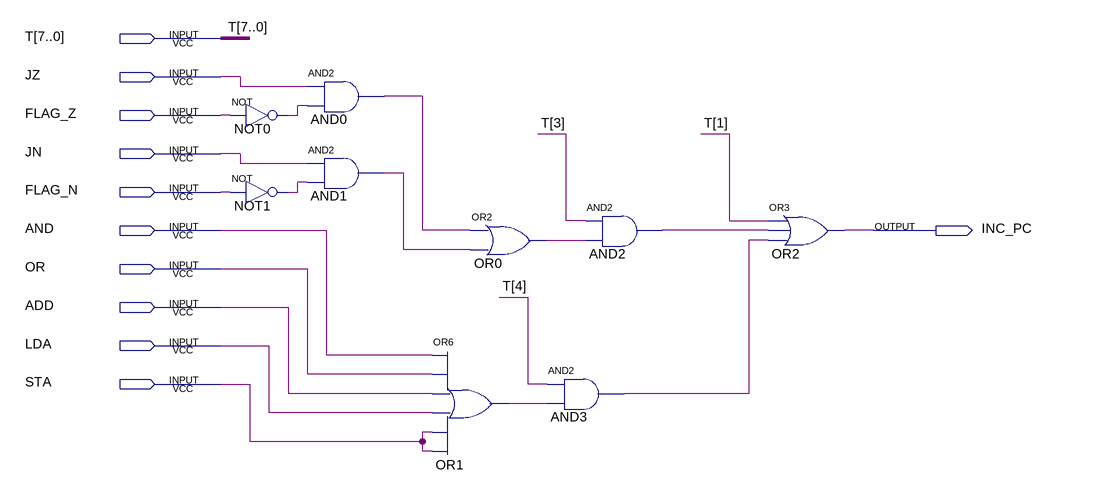
[diagram p0: schematic sheet]
// Quartus schematic INC_PC.bdf as structural Verilog: 9 symbols, 11 pins
module INC_PC (
  input  [7:0] T,
  input  JZ,
  input  FLAG_Z,
  input  JN,
  input  FLAG_N,
  input  AND,
  input  OR,
  input  ADD,
  input  LDA,
  input  STA,
  output INC_PC
);

  wire AND0_out, AND1_out, AND2_out, AND3_out, NOT0_out, NOT1_out, OR0_out, OR1_out;

  not NOT0 (NOT0_out, FLAG_Z);
  not NOT1 (NOT1_out, FLAG_N);
  and AND0 (AND0_out, JZ, NOT0_out);
  and AND1 (AND1_out, JN, NOT1_out);
  or OR0 (OR0_out, AND0_out, AND1_out);
  or OR1 (OR1_out, AND, OR, ADD, LDA, STA, STA);
  and AND3 (AND3_out, T[4], OR1_out);
  and AND2 (AND2_out, T[3], OR0_out);
  or OR2 (INC_PC, T[1], AND2_out, AND3_out);
endmodule
